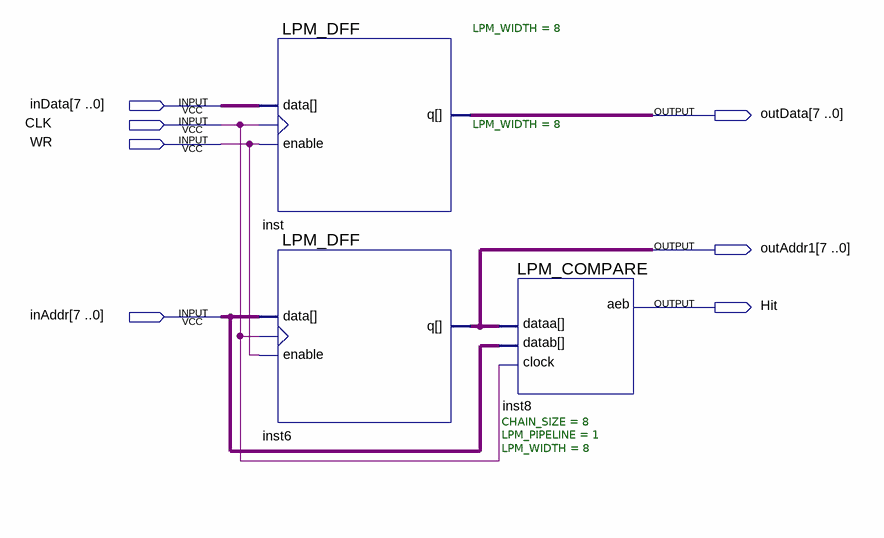
[diagram p0: schematic sheet]
// Quartus schematic cacheBlock.bdf as structural Verilog: 3 symbols, 7 pins
module cacheBlock (
  input  [7:0] inData,
  input  CLK,
  input  WR,
  input  [7:0] inAddr,
  output [7:0] outData,
  output [7:0] outAddr1,
  output Hit
);

  LPM_DFF #(.LPM_WIDTH(8)) inst (.enable(WR), .clock(CLK), .data(inData), .q(outData));
  LPM_DFF #(.LPM_WIDTH(8)) inst6 (.enable(WR), .clock(CLK), .data(inAddr), .q(outAddr1));
  LPM_COMPARE #(.CHAIN_SIZE(8), .LPM_PIPELINE(1), .LPM_WIDTH(8)) inst8 (
    .dataa(outAddr1), .datab(inAddr), .clock(CLK), .aeb(Hit));
endmodule
